# Altium schematic sheet User - User Interface.SchDoc: [22] User - User Interface
size A4; ApprovedBy: Nagy Richard; CheckedBy: Nagy Richard; Author: Nagy Richard; CompanyName: EmbedCore; DrawnBy: Nagy Richard; Engineer: Nagy Richard; Organization: EmbedCore; DocumentNumber: 22; Revision: 1.0; SheetNumber: 22; SheetTotal: 22
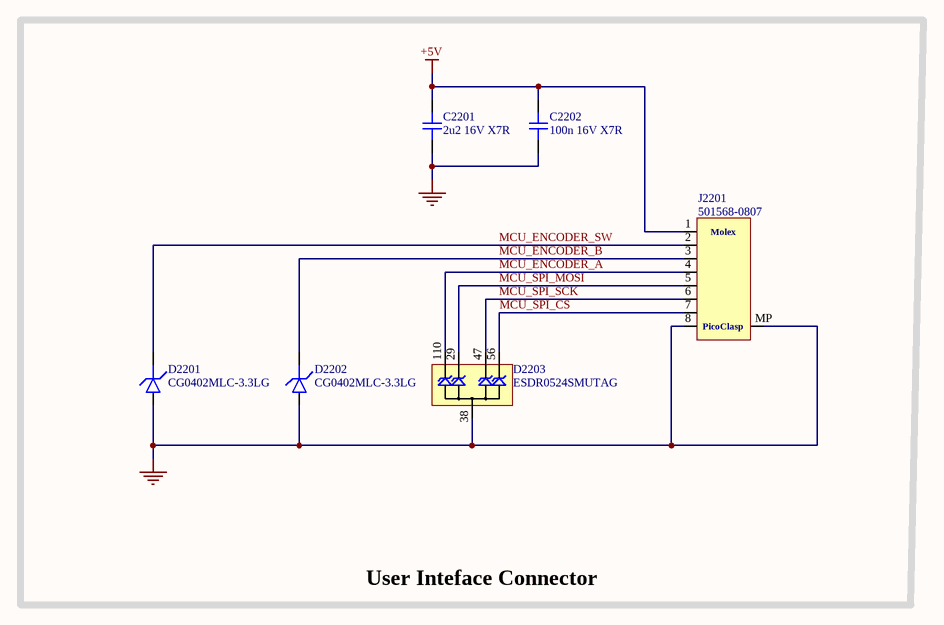
[diagram p0: User - User Interface.SchDoc]

## Parts
C2201  2u2 16V X7R  [CAP_0603]
C2202  100n 16V X7R  [CAP_0402]
D2201  CG0402MLC-3.3LG  [D_0402]
D2202  CG0402MLC-3.3LG  [D_0402]
D2203  ESDR0524SMUTAG  [uDFN-10-WIDE]
J2201  501568-0807  [501568-0807]

## Blocks framed on the sheet
User Inteface Connector: C2201 C2202 D2201-D2203 J2201

## Nets
+5V: C2201.2 C2202.2 J2201.1
GND: C2201.1 C2202.1 D2201.A D2202.A D2203.38(GND) J2201.8 J2201.MP
MCU_ENCODER_A: D2203.110 J2201.4
MCU_ENCODER_B: D2202.K J2201.3
MCU_ENCODER_SW: D2201.K J2201.2
MCU_SPI_CS: D2203.56 J2201.7
MCU_SPI_MOSI: D2203.29 J2201.5
MCU_SPI_SCK: D2203.47 J2201.6

## Notes on the sheet
- Title:
- Drawn By:
- Page Contents:
- Checked By:
- Size:
- Date:
- File:
- License:
- Email:
- A4
- Number:
- Time:
- Revision:
- Sheet
- Website:
- of
- (in symbol 501568-0807) PicoClasp

## Library data of the parts
C2201 = CAP_0603: Capacitor SMD 0603; Manufacturer: YAGEO; Manufacturer Part Number: CC0603KRX7R7BB225; Distributor Link: www.lcsc.com; LCSC: C914769; Rating: *; Dielectric: *
C2202 = CAP_0402: Capacitor SMD 0402; Manufacturer: YAGEO; Manufacturer Part Number: CC0402JRX7R7BB104; Distributor Link: www.lcsc.com; LCSC: C541464; Rating: *; Dielectric: *
D2201 D2202 = D_TVS_0402: Diode TVS / ESD 0402
D2203 = ESDR0524SMUTAG: TVS Diode Array Low Capacitance ESD Protection 4-Channel (Vwork=5V, Vclamp=15V); Manufacturer: onsemi; Manufacturer Part Number: ESDR0524SMUTAG; Distributor Link: https://www.mouser.de/ProductDetail/onsemi/ESDR0524SMUTAG?qs=NJQfjRgVp6Qe%2FuopsuIgOg%3D%3D; LCSC: C890633
J2201 = 501568-0807: 1.00mm Pitch, Pico-Clasp PCB Header, Single Row, Right-Angle, Surface Mount, Tin Plated, Outer Positive Lock, 8 Circuits, Natural; Manufacturer: Molex; Manufacturer Part Number: 501568-0807